# Altium schematic sheet DC-step-down.SchDoc
size A4; SheetNumber: 7; SheetTotal: 21
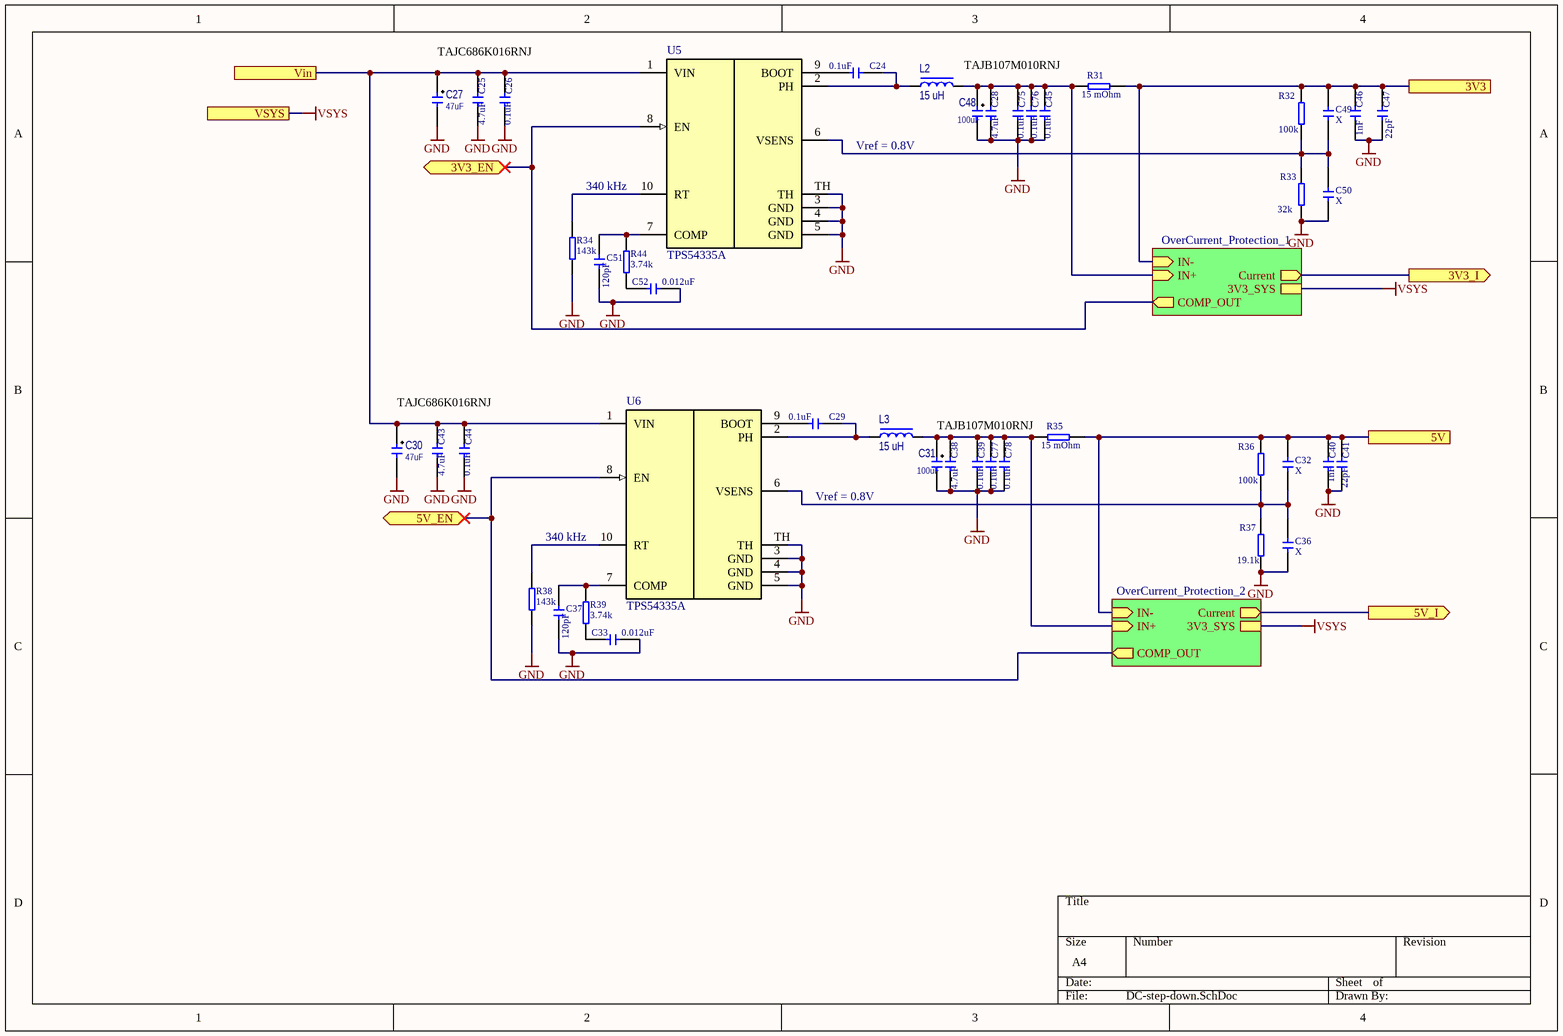
[diagram p0: DC-step-down.SchDoc]

## Parts
C24  value 0.1uF  [CERCAP 0402]
C25  value 4.7uF  [CERCAP 0603]
C26  value 0.1uF  [CERCAP 0402]
C27  value 47uF  [TECAP B]  (hidden comment: TAJC686K016RNJ)
C28  value 4.7uF  [CERCAP 0603]
C29  value 0.1uF  [CERCAP 0402]
C30  value 47uF  [TECAP B]  (hidden comment: TAJC686K016RNJ)
C31  value 100uF  [TECAP B]  (hidden comment: TAJB107M010RNJ)
C32  value X  [CERCAP 0402]  (no BOM)
C33  value 0.012uF  [CERCAP 0402]
C36  value X  [CERCAP 0402]  (no BOM)
C37  value 120pF  [CERCAP 0402]
C38  value 4.7uF  [CERCAP 0603]
C39  value 0.1uF  [CERCAP 0402]
C40  value 1nF  [CERCAP 0402]
C41  value 22pF  [CERCAP 0402]
C43  value 4.7uF  [CERCAP 0603]
C44  value 0.1uF  [CERCAP 0402]
C45  value 0.1uF  [CERCAP 0402]
C46  value 1nF  [CERCAP 0402]
C47  value 22pF  [CERCAP 0402]
C48  value 100uF  [TECAP B]  (hidden comment: TAJB107M010RNJ)
C49  value X  [CERCAP 0402]  (no BOM)
C50  value X  [CERCAP 0402]  (no BOM)
C51  value 120pF  [CERCAP 0402]
C52  value 0.012uF  [CERCAP 0402]
C75  value 0.1uF  [CERCAP 0402]
C76  value 0.1uF  [CERCAP 0402]
C77  value 0.1uF  [CERCAP 0402]
C78  value 0.1uF  [CERCAP 0402]
L2  value 15 uH  [IND-5x5]  (hidden comment: IND-5x5 15 uH)
L3  value 15 uH  [IND-5x5]  (hidden comment: IND-5x5 15 uH)
R31  value 15 mOhm  [RES 1210]
R32  value 100k  [RES 0402]
R33  value 32k  [RES 0402]
R34  value 143k  [RES 0402]
R35  value 15 mOhm  [RES 1210]
R36  value 100k  [RES 0402]
R37  value 19.1k  [RES 0402]
R38  value 143k  [RES 0402]
R39  value 3.74k  [RES 0402]
R44  value 3.74k  [RES 0402]
U5  TPS54335A  [VSON-10]
U6  TPS54335A  [VSON-10]

## Sub-sheets
OverCurrent_Protection_1 = OverCurrent_Protection.SchDoc: IN- (in), IN+ (in), Current (out), COMP_OUT (out), 3V3_SYS
OverCurrent_Protection_2 = OverCurrent_Protection.SchDoc: IN- (in), IN+ (in), Current (out), COMP_OUT (out), 3V3_SYS

## Ports
3V3, 3V3_EN (bidir), 3V3_I (out), 5V, 5V_EN (bidir), 5V_I (out), Vin, VSYS

## Nets
GND: C25.1 C26.1 C27.2(-) C28.1 C30.2(-) C31.2(-) C33.1 C36.1 C37.2 C38.1 C39.1 C40.1 C41.1 C43.1 C44.1 C45.1 C46.1 C47.1 C48.2(-) C50.1 C51.2 C52.1 C75.1 C76.1 C77.1 C78.1 R33.1 R34.1 R37.1 R38.1 U5.3(GND) U5.4(GND) U5.5(GND) U5.TH U6.3(GND) U6.4(GND) U6.5(GND) U6.TH
VSYS: port VSYS, sheet OverCurrent_Protection_1/3V3_SYS, sheet OverCurrent_Protection_2/3V3_SYS
3V3: C46.2 C47.2 C49.2 R31.2 R32.2 ; port 3V3, sheet OverCurrent_Protection_1/IN-
3V3_EN: U5.8(EN) ; port 3V3_EN, sheet OverCurrent_Protection_1/COMP_OUT
3V3_I: port 3V3_I, sheet OverCurrent_Protection_1/Current
5V: C32.2 C40.2 C41.2 R35.2 R36.2 ; port 5V, sheet OverCurrent_Protection_2/IN-
5V_EN: U6.8(EN) ; port 5V_EN, sheet OverCurrent_Protection_2/COMP_OUT
5V_I: port 5V_I, sheet OverCurrent_Protection_2/Current
Vin: C25.2 C26.2 C27.1(+) C30.1(+) C43.2 C44.2 U5.1(VIN) U6.1(VIN) ; port Vin
NetC24_1: C24.1 U5.9(BOOT)
NetC24_2: C24.2 L2.1 U5.2(PH)
NetC28_2: C28.2 C45.2 C48.1(+) C75.2 C76.2 L2.2 R31.1 ; sheet OverCurrent_Protection_1/IN+
NetC29_1: C29.1 U6.9(BOOT)
NetC29_2: C29.2 L3.1 U6.2(PH)
NetC31_1: C31.1(+) C38.2 C39.2 C77.2 C78.2 L3.2 R35.1 ; sheet OverCurrent_Protection_2/IN+
NetC32_1: C32.1 C36.2 R36.1 R37.2 U6.6(VSENS)
NetC33_2: C33.2 R39.1
NetC37_1: C37.1 R39.2 U6.7(COMP)
NetC49_1: C49.1 C50.2 R32.1 R33.2 U5.6(VSENS)
NetC51_1: C51.1 R44.2 U5.7(COMP)
NetC52_2: C52.2 R44.1
NetR34_2: R34.2 U5.10(RT)
NetR38_2: R38.2 U6.10(RT)

## Notes on the sheet
- TAJC686K016RNJ
- TAJB107M010RNJ
- Vref = 0.8V
- 340 kHz
- (near R35) TAJB107M010RNJ

## Library data of the parts
C24 C26 C29 C32 C33 C36 C37 C39-C41 C44-C47 C49-C52 C75-C78 = !Capacitor: Capacitor; IsSMT: NoSMT; Voltage: 50V; Diel: X7R
C25 C43 = !Capacitor: Capacitor; IsSMT: NoSMT; Voltage: 16V; Diel: X7R
C27 C30 C31 C48 = CapacitorP: Capacitor Polar; IsSMT: NoSMT; Diel: X7R; Voltage: *
C28 C38 = !Capacitor: Capacitor; IsSMT: NoSMT; Voltage: 10V; Diel: X7R
L2 L3 = Inductor: IsSMT: NoSMT
R31-R39 R44 = !Resistor: Resistor; IsSMT: NoSMT
U5 U6 = TPS54335A: buck sync wEN woPG